# EAGLE design Rotary_Angle_Card (EAGLE 6.4)

## Sheet 1 of 2
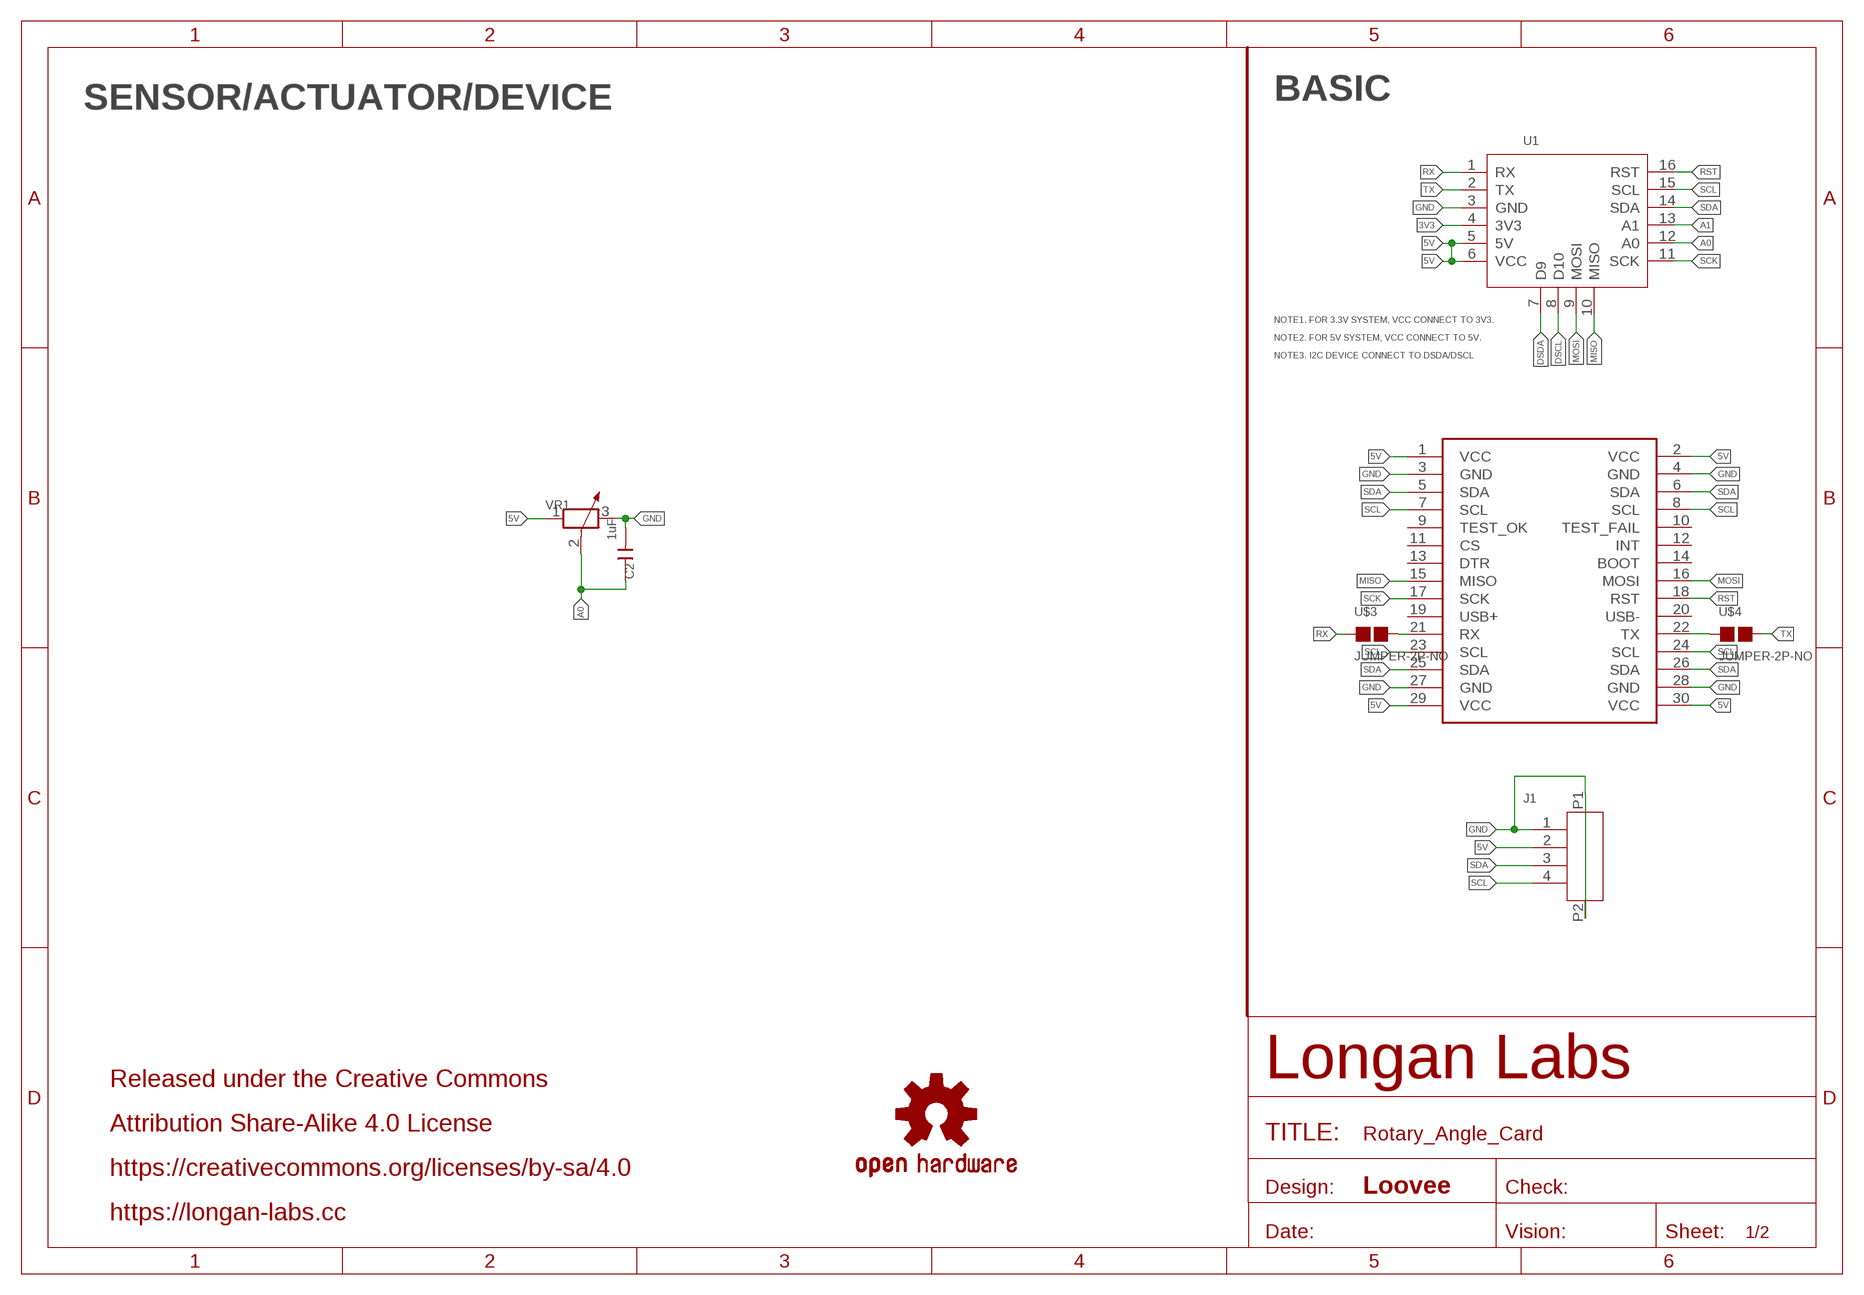
[diagram p0: schematic, sheet 1]

### Parts
C2  1uF  CAP-0603  [C0603]
J1  HEADER-4P-1.0  [4P-1.0-90D]
LOGO2  OSHW-LOGOS  [OSHW-LOGO-S]
MOUDLE1  MOUDLE-2X15P-2.54'BOARD'  [MOUDLE-2X15P-2.54]
U1  MOUDLE-CARDS  [16P-2.0-CARDS]
U$3  JUMPER-2P-NO  [2P-SMD-NO]
U$4  JUMPER-2P-NO  [2P-SMD-NO]
VR1  RES-ADJ  [2+3P-L11*W9.8*H12MM]

### Nets
3V3: U1.4(3V3)
5V: J1.2 MOUDLE1.1(VCC) MOUDLE1.2(VCC) MOUDLE1.29(VCC) MOUDLE1.30(VCC) U1.5(5V) U1.6(VCC) VR1.1
A0: C2.1 U1.12(A0) VR1.2
A1: U1.13(A1)
DSCL: U1.8(D10)
DSDA: U1.7(D9)
GND: C2.2 J1.1 J1.P1 J1.P2 MOUDLE1.3(GND) MOUDLE1.4(GND) MOUDLE1.27(GND) MOUDLE1.28(GND) U1.3(GND) VR1.3
MISO: MOUDLE1.15(MISO) U1.10(MISO)
MOSI: MOUDLE1.16(MOSI) U1.9(MOSI)
N$1: MOUDLE1.21(RX) U$3.2
N$2: MOUDLE1.22(TX) U$4.1
RST: MOUDLE1.18(RST) U1.16(RST)
RX: U1.1(RX) U$3.1
SCK: MOUDLE1.17(SCK) U1.11(SCK)
SCL: J1.4 MOUDLE1.7(SCL) MOUDLE1.8(SCL) MOUDLE1.23(SCL) MOUDLE1.24(SCL) U1.15(SCL)
SDA: J1.3 MOUDLE1.5(SDA) MOUDLE1.6(SDA) MOUDLE1.25(SDA) MOUDLE1.26(SDA) U1.14(SDA)
TX: U1.2(TX) U$4.2
Unconnected: MOUDLE1.9(TEST_OK) MOUDLE1.10(TEST_FAIL) MOUDLE1.11(CS) MOUDLE1.12(INT) MOUDLE1.13(DTR) MOUDLE1.14(BOOT) MOUDLE1.19(USB+) MOUDLE1.20(USB-)

### Notes on the sheet
- SENSOR/ACTUATOR/DEVICE | BASIC
- NOTE1. FOR 3.3V SYSTEM, VCC CONNECT TO 3V3.
- NOTE2. FOR 5V SYSTEM, VCC CONNECT TO 5V.
- NOTE3. I2C DEVICE CONNECT TO DSDA/DSCL
- Released under the Creative Commons
- Attribution Share-Alike 4.0 License
- https://creativecommons.org/licenses/by-sa/4.0
- Loovee
- https://longan-labs.cc

## Sheet 2 of 2

## Library data of the parts
C2 = Discrete-new:CAP: Ceramic Capacitors
J1 = Longan-Connect:HEADER-4P-1.0
LOGO2 = SparkFun-Aesthetics:OSHW-LOGO: Open-Source Hardware (OSHW) Logo This logo indicates the piece of hardware it is found on incorporates a OSHW license and/or adheres to the definition of open source hardware found here: http://freedomdefined.org/OSHW
MOUDLE1 = Longan-moudle:MOUDLE-2X15P-2.54
U1 = MOUDLE-CARDS:MOUDLE-CARDS
U$3 U$4 = Discrete-new:JUMPER-2P-NO
VR1 = RES-ADJ:RES-ADJ: Potentiometer

## Board
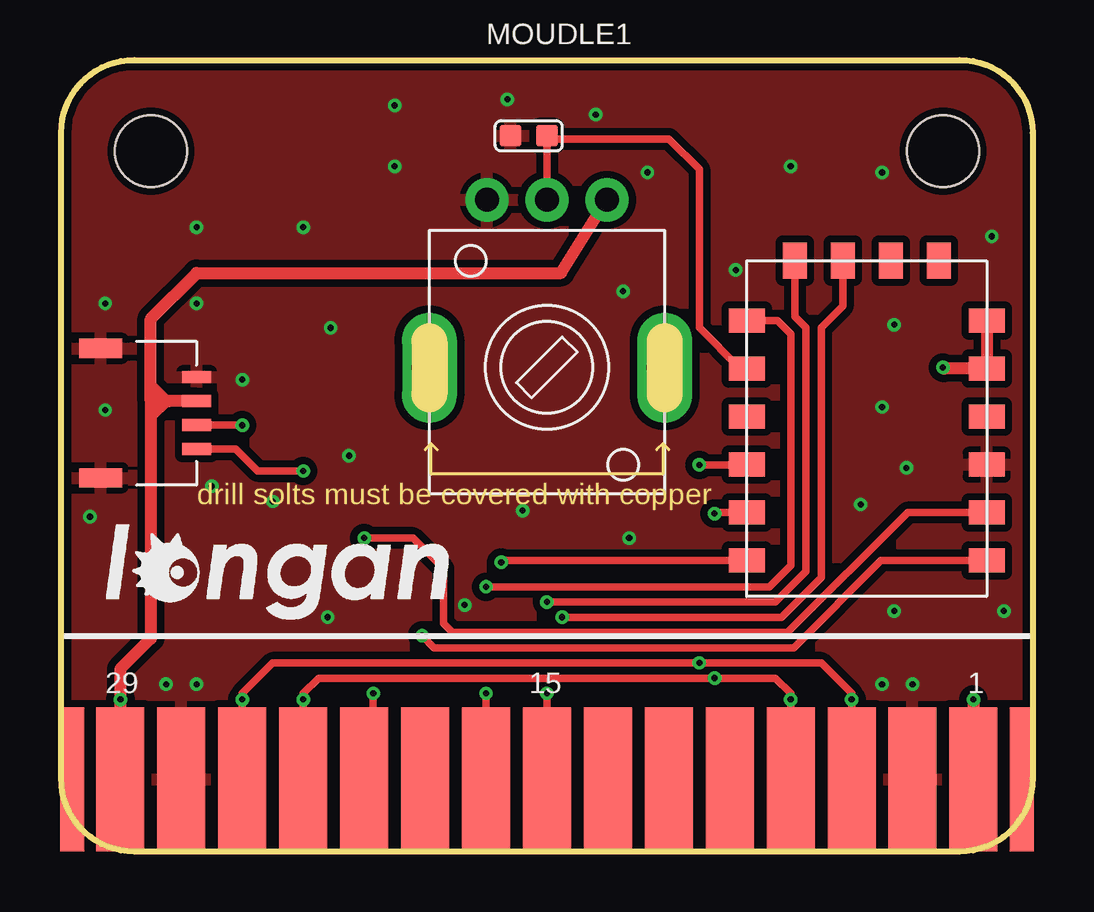
[diagram p1: board, top side]
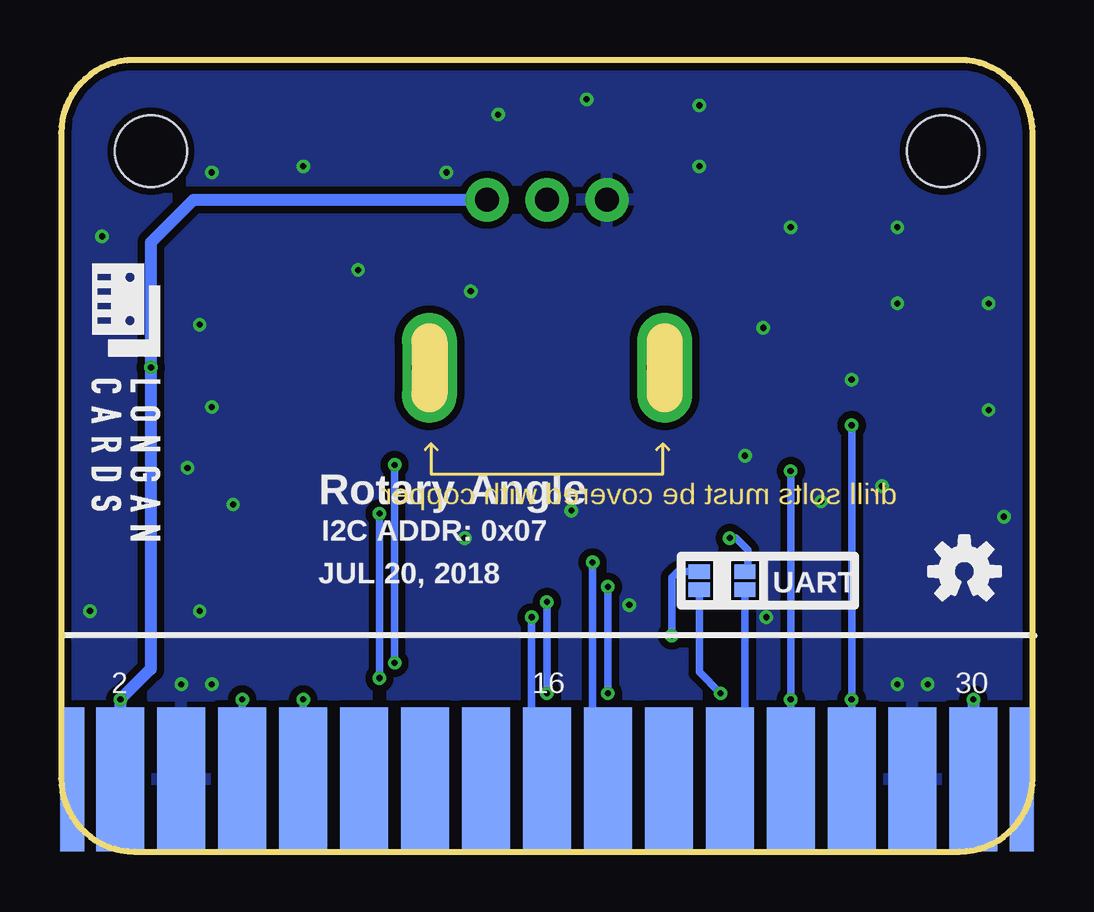
[diagram p2: board, bottom side, seen from below]

Size 40.5 x 33 mm. Coordinates in mm from the lower left corner, seen from the top.
Copper layers (1*16): Top 0.035mm / dielectric 1.5mm / Bottom 0.035mm
Design rules "SeeedStudio_2layer_DRU_no_angle_20140221 *": minimum track width 6mil, minimum drill 10mil, track to track 6mil, track to pad 6mil, pad to pad 6mil, via to via 6mil, smd to smd 0mil, copper to edge 10mil, drill to drill 10mil, minimum pad ring 10mil, minimum via ring 6mil, stop-mask expansion 2mil, vias tented up to drill 25mil, thermal gap 10mil

### Footprints (pad centres in the part's own frame; a part is rotated, then mirrored left to right if it is on the bottom)
C0603 = smd 0.889 x 0.889: 1 0,0.762; 2 0,-0.762
4P-1.0-90D = smd 1.2 x 0.5: 1 0,1.5; 2 0,0.5; 3 0,-0.5; 4 0,-1.5 | smd 1.8 x 0.8: P1 -4,2.7; P2 -4,-2.7
MOUDLE-2X15P-2.54 = smd 2 x 6: 1 17.78,-13.492; 3 15.24,-13.492; 5 12.7,-13.492; 7 10.16,-13.492; 9 7.62,-13.492; 11 5.08,-13.492; 13 2.54,-13.492; 15 0,-13.492; 17 -2.54,-13.492; 19 -5.08,-13.492; 21 -7.62,-13.492; 23 -10.16,-13.492; 25 -12.7,-13.492; 27 -15.24,-13.492; 29 -17.78,-13.492 | smd 2 x 6 bottom: 2 17.78,-13.492; 4 15.24,-13.492; 6 12.7,-13.492; 8 10.16,-13.492; 10 7.62,-13.492; 12 5.08,-13.492; 14 2.54,-13.492; 16 0,-13.492; 18 -2.54,-13.492; 20 -5.08,-13.492; 22 -7.62,-13.492; 24 -10.16,-13.492; 26 -12.7,-13.492; 28 -15.24,-13.492; 30 -17.78,-13.492 | smd 1 x 6: P1 -19.8,-13.492; P4 19.8,-13.492 | smd 1 x 6 bottom: P2 -19.8,-13.492; P3 19.8,-13.492 | hole 3: -16.51,12.7; 16.51,12.7
16P-2.0-CARDS = smd 1.5 x 1: 1 -5,5; 2 -5,3; 3 -5,1; 4 -5,-1; 5 -5,-3; 6 -5,-5; 11 5,-5; 12 5,-3; 13 5,-1; 14 5,1; 15 5,3; 16 5,5 | smd 1 x 1.5: 7 -3,-7.5; 8 -1,-7.5; 9 1,-7.5; 10 3,-7.5
2P-SMD-NO = smd 0.889 x 0.61: 1 0,0.381; 2 0,-0.381
2+3P-L11*W9.8*H12MM = drill 1 pad 1.8: 1 0,2.5; 2 0,0; 3 0,-2.5 | drill 1.5 pad 2.3 long: P1 7,4.9; P2 7,-4.9

### Placement (x,y rotation side)
C2  19.49,29.84 270 top
J1  5.64,18.28 0 top
LOGO2  2.85,11.67 0 bottom
MOUDLE1  20.25,16.5 0 top
U1  33.59,17.14 180 top
U$1  [LONGAN-CARDS-SMALL]  39.55,25.01 270 bottom
U$2  [LONGAN-SILK-SMALLER]  0.57,8.5 0 top
U$3  13.9,11.29 0 bottom
U$4  11.99,11.29 180 bottom
VR1  20.25,27.17 270 top

### Tracks (layer width: path | path; a pad name or v marks a point on that pad's centre or on a via)
5V  (via drill 0.25 pad 0.51)
  Top 0.508: v38.03,6.34 MOUDLE1.2 | MOUDLE1.30 v2.47,6.34 2.47,7.61 3.74,8.88 3.74,18.15 | J1.2 4.49,18.78 | 4.49,18.78 3.74,18.79 | 3.74,18.79 3.74,18.15 | 3.74,18.79 3.74,19.42 | 4.49,18.78 4.38,18.78 | 4.38,18.78 3.74,19.42 | 4.38,18.78 4.37,18.78 3.74,18.15 | 3.74,19.42 3.74,22.21 5.64,24.12 20.84,24.12 VR1.1 | v36.76,20.18 36.81,20.13 U1.5 U1.6
  Bottom 0.508: MOUDLE1.2 v38.03,6.34 36.76,7.61 v36.76,20.18 36.76,25.39 34.98,27.17 VR1.1 | v2.47,6.34 2.47,3.67 2.34,3.55 2.34,3.13 MOUDLE1.30
A0
  Top 0.305: VR1.2 C2.1 20.38,29.71 25.33,29.71 26.6,28.44 26.6,21.83 28.3,20.13 U1.12
GND  (via drill 0.25 pad 0.51)
  other vias: 4.38,6.97 5.64,6.97 34.22,6.97 35.49,6.97 7.55,19.68 1.84,18.41 1.84,22.85 5.64,22.85 1.2,13.96 6.28,15.23 8.82,14.6 18.6,31.36 13.9,31.11 13.9,28.56 30.41,28.56 39.3,10.02 5.64,26.02 10.09,26.02 11.99,16.5 11.23,21.83 22.28,30.72 24.44,28.31 28.12,24.25 34.73,21.96 38.79,25.64 34.22,28.31 34.22,18.53 33.33,14.47 35.24,15.99 34.73,10.02 16.82,10.28 11.11,9.77 19.23,14.21 23.68,13.07 23.43,23.36
  pour Bottom (isolate 0.305): -0.07,33.01 40.57,33.01 40.57,-0.01 -0.07,-0.01
  pour Top (isolate 0.305): -0.07,33.01 40.57,33.01 40.57,-0.01 -0.07,-0.01
MISO  (via drill 0.25 pad 0.51)
  Top 0.305: MOUDLE1.15 v20.25,6.59 | U1.10 30.59,22.29 31.05,21.83 31.05,11.67 29.77,10.4 v20.25,10.4
  Bottom 0.305: v20.25,10.4 v20.25,6.59
MOSI  (via drill 0.25 pad 0.51)
  Top 0.305: v20.89,9.77 30.03,9.77 31.68,11.42 31.68,21.83 32.59,22.74 U1.9
  Bottom 0.305: MOUDLE1.16 20.25,4.44 20.89,5.07 v20.89,9.77
N$1  (via drill 0.25 pad 0.51)
  Top 0.305: v13.01,6.59 13.01,3.39 MOUDLE1.21
  Bottom 0.305: U$3.2 13.9,7.48 v13.01,6.59
N$2
  Bottom 0.305: U$4.1 11.99,3.64 MOUDLE1.22
RST  (via drill 0.25 pad 0.51)
  Top 0.305: U1.16 18.43,12.13 v18.34,12.05
  Bottom 0.305: MOUDLE1.18 18.06,3.01 18.34,3.29 v18.34,12.05
RX  (via drill 0.25 pad 0.51)
  Top 0.305: U1.1 34.17,12.13 30.54,8.5 15.55,8.5 v15.04,9.01
  Bottom 0.305: v15.04,9.01 15.04,11.42 14.79,11.67 U$3.1
SCK  (via drill 0.25 pad 0.51)
  Top 0.305: MOUDLE1.17 v17.71,6.59 | U1.11 29.86,22.13 30.41,21.58 30.41,11.93 29.52,11.04 v17.71,11.04
  Bottom 0.305: v17.71,11.04 v17.71,6.59
SCL  (via drill 0.25 pad 0.51)
  Top 0.305: MOUDLE1.8 v30.41,6.34 30.41,6.59 29.77,7.23 v27.23,7.23 10.72,7.23 10.09,6.59 v10.09,6.34 MOUDLE1.23 | J1.4 7.27,16.78 8.19,15.87 v10.09,15.87 | U1.15 27.28,14.13 v27.23,14.09
  Bottom 0.305: v30.41,6.34 MOUDLE1.8 | MOUDLE1.23 v10.09,6.34 v10.09,15.87 | v27.23,14.09 v27.23,7.23
SDA  (via drill 0.25 pad 0.51)
  Top 0.305: MOUDLE1.6 v32.95,6.34 32.95,6.59 31.68,7.86 v26.6,7.86 8.82,7.86 7.55,6.59 v7.55,6.34 MOUDLE1.25 | v7.55,17.77 v7.54,17.78 J1.3 | v26.6,16.12 28.57,16.12 U1.14
  Bottom 0.305: v32.95,6.34 MOUDLE1.6 | MOUDLE1.25 v7.55,6.34 v7.55,17.77 | v26.6,7.86 v26.6,16.12
TX  (via drill 0.25 pad 0.51)
  Top 0.305: U1.2 35.28,14.13 30.28,9.13 16.31,9.13 15.93,9.52 15.93,11.8 14.66,13.07 v12.63,13.07
  Bottom 0.305: v12.63,13.07 12.38,13.07 11.87,12.56 11.87,11.8 U$4.2

### Text on the board
bPlace: Rotary Angle | I2C ADDR: 0x07 | JUL 20, 2018 | UART